# Altium project Golden_Nonce_Rev01.PrjPCB (part 2 of 6)

## Sheet GS_02_Core.SchDoc: Title
size A2; Date: Date; CompanyName: Integrated Micro-Electronics Bulgaria; Organization: Design & Development Department; Address1: Drawing Type; Address2: Address 1; Address3: Address 2; Address4: Address 3; DocumentNumber: 730xxx; Revision: 01; SheetNumber: 1; SheetTotal: 1; PageSetup: Record=PageOptions|CenterHorizontal=True|CenterVertical=True|PrintScale=0.70|XCorrection=1.00|YCorrection=1.00|PrintKind=2|BorderSize=5000000|LeftOffset=0|BottomOffset=0|Orientation=2|PaperLength=1000|PaperWidth=1000|Scale=100|PaperSource=7|PrintQuality=-4|MediaType=1|DitherType=10|PaperKind=A4|PrintScaleMode=1; SheetSize: A3; Time: Time; ModifiedDate: Mod. Date
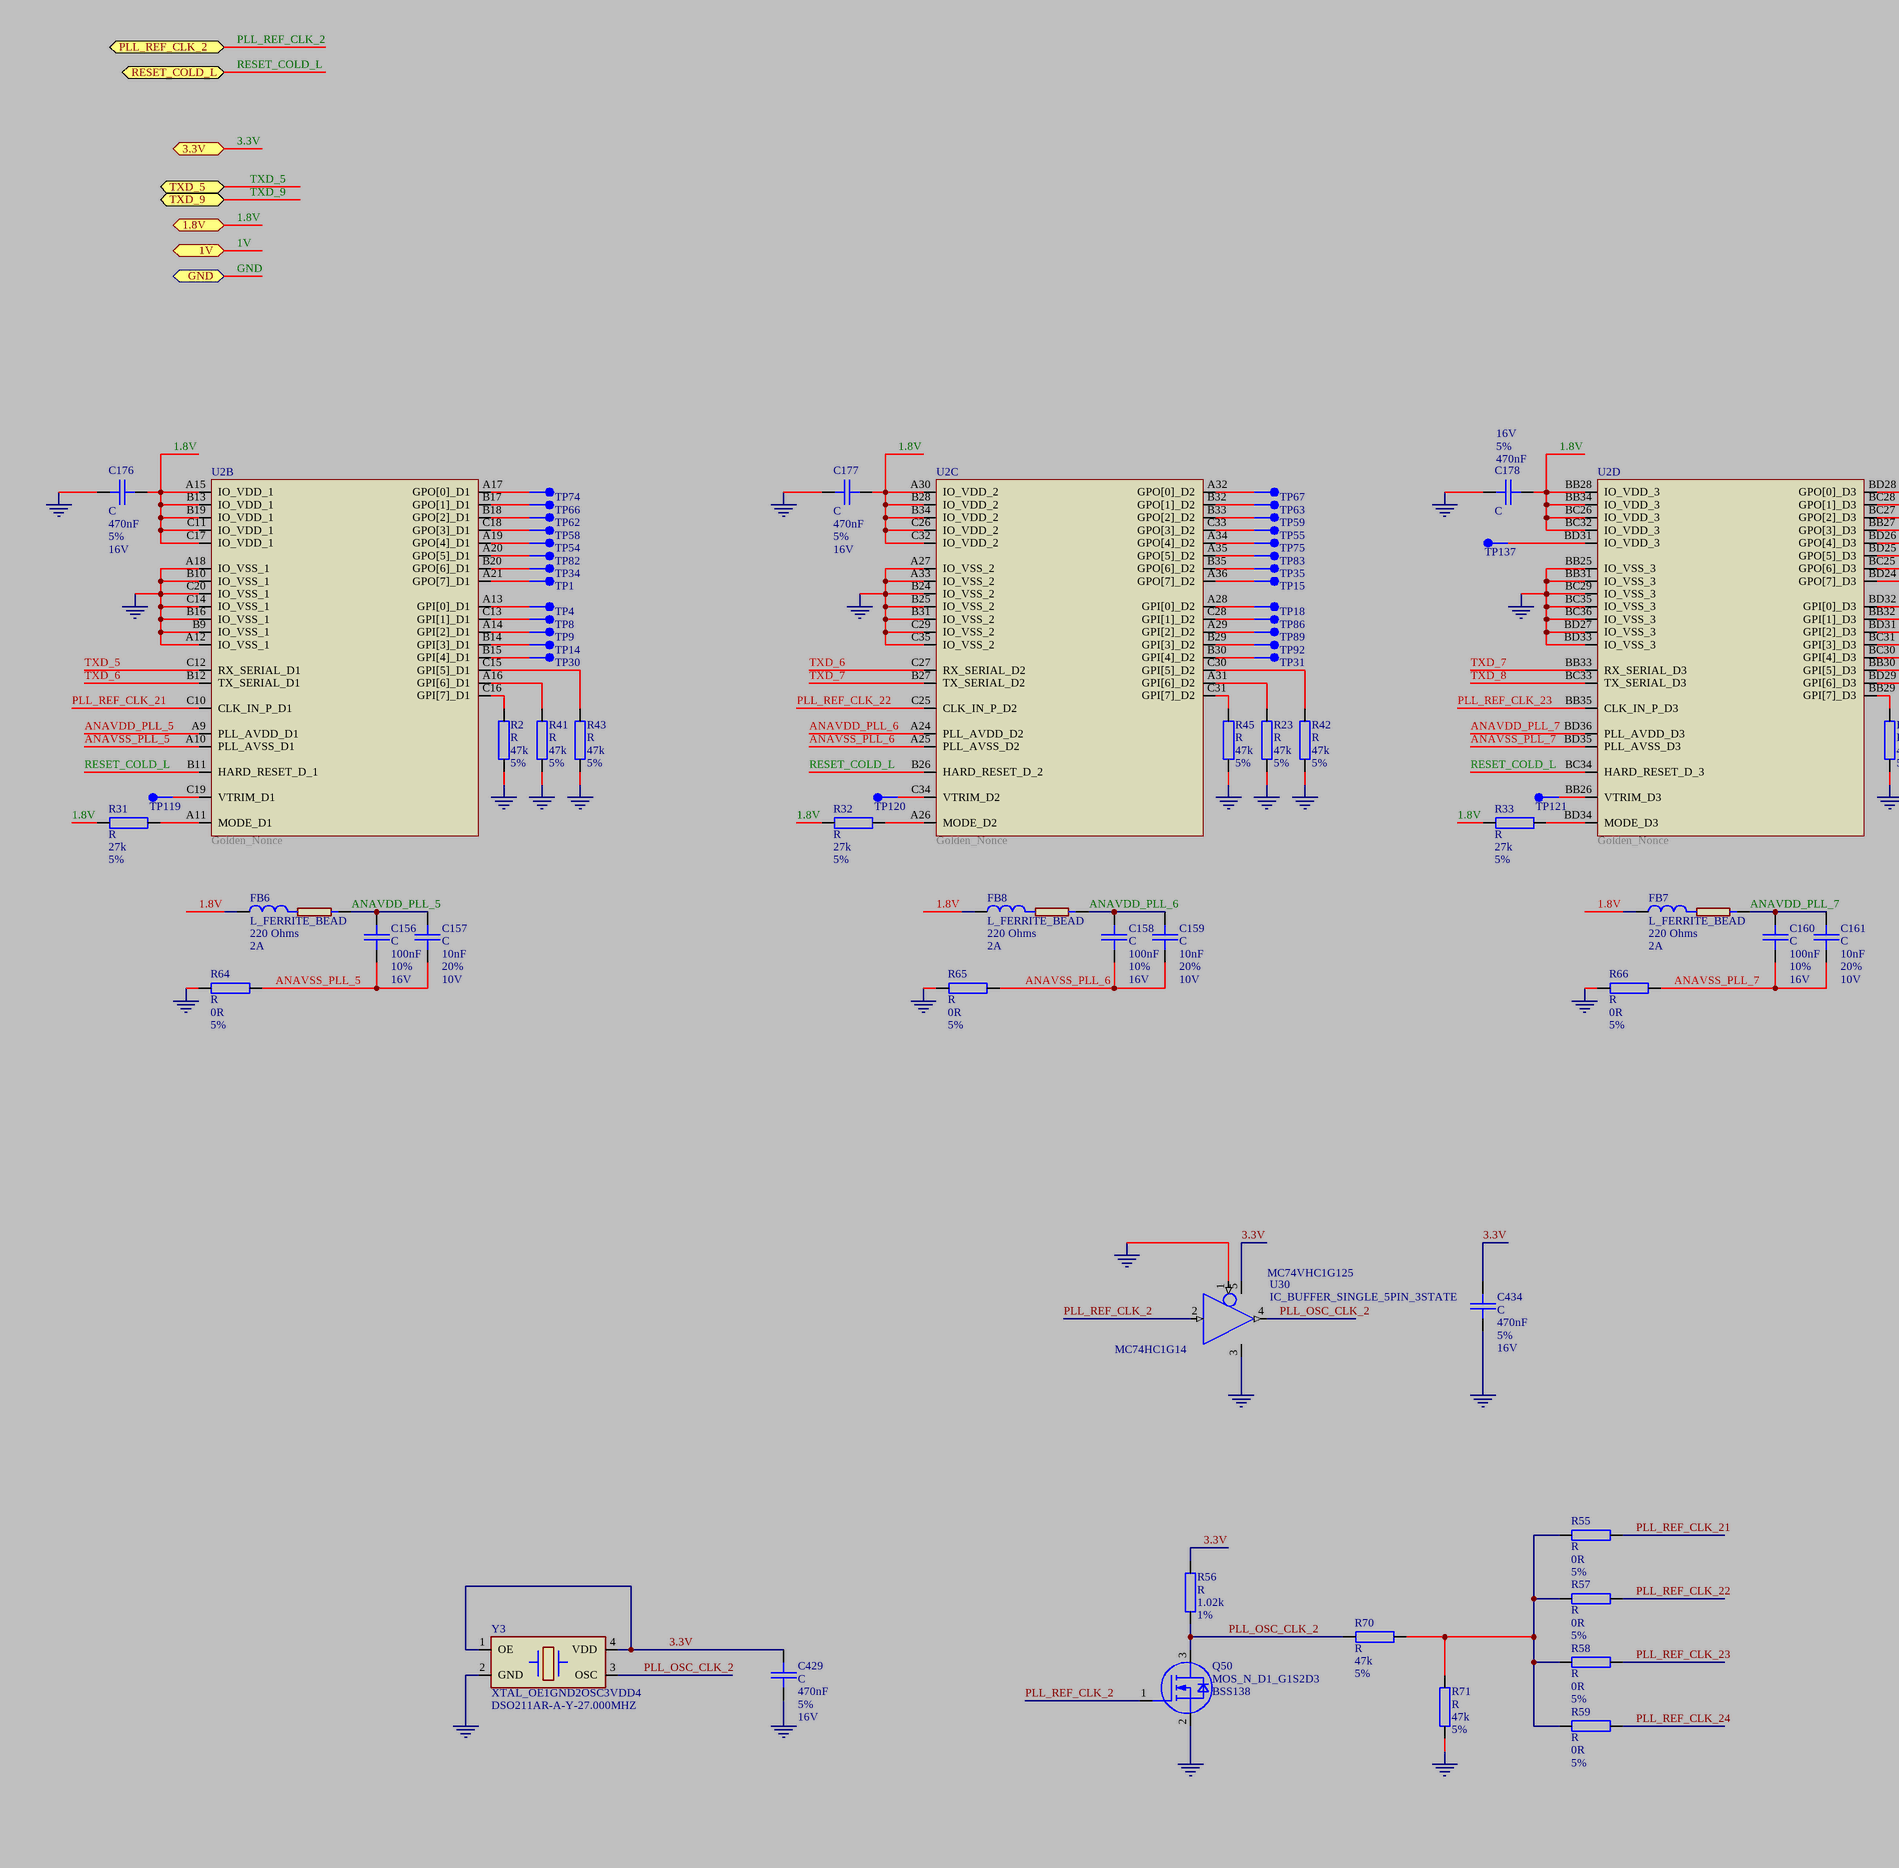
[diagram p3: GS_02_Core.SchDoc, left]
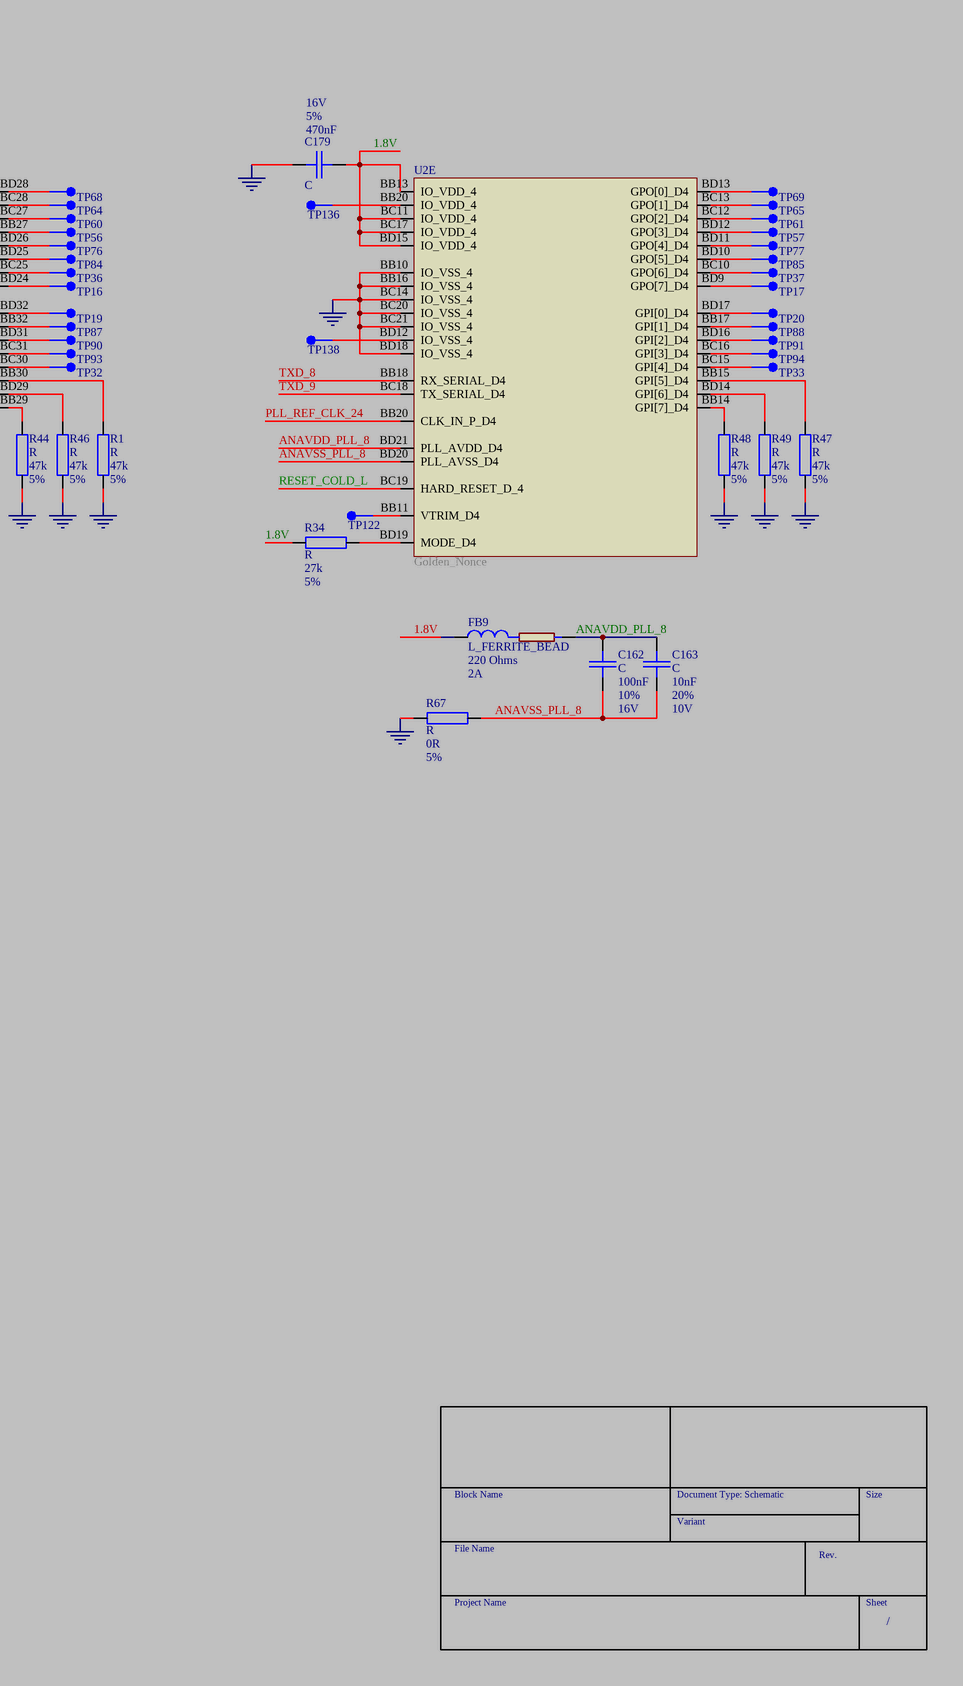
[diagram p4: GS_02_Core.SchDoc, right]

### Parts
C156  C  DB_VALUE: 100nF  DB_TOLERANCE: 10%  DB_VOLTAGE: 16V  [SMD_0603_CAPC1608X95N]
C157  C  DB_VALUE: 10nF  DB_TOLERANCE: 20%  DB_VOLTAGE: 10V  [SMD_0603_CAPC1608X95N]
C158  C  DB_VALUE: 100nF  DB_TOLERANCE: 10%  DB_VOLTAGE: 16V  [SMD_0603_CAPC1608X95N]
C159  C  DB_VALUE: 10nF  DB_TOLERANCE: 20%  DB_VOLTAGE: 10V  [SMD_0603_CAPC1608X95N]
C160  C  DB_VALUE: 100nF  DB_TOLERANCE: 10%  DB_VOLTAGE: 16V  [SMD_0603_CAPC1608X95N]
C161  C  DB_VALUE: 10nF  DB_TOLERANCE: 20%  DB_VOLTAGE: 10V  [SMD_0603_CAPC1608X95N]
C162  C  DB_VALUE: 100nF  DB_TOLERANCE: 10%  DB_VOLTAGE: 16V  [SMD_0603_CAPC1608X95N]
C163  C  DB_VALUE: 10nF  DB_TOLERANCE: 20%  DB_VOLTAGE: 10V  [SMD_0603_CAPC1608X95N]
C176  C  DB_VALUE: 470nF  DB_TOLERANCE: 5%  DB_VOLTAGE: 16V  [SMD_0603_CAPC1608X95N]
C177  C  DB_VALUE: 470nF  DB_TOLERANCE: 5%  DB_VOLTAGE: 16V  [SMD_0603_CAPC1608X95N]
C178  C  DB_VALUE: 470nF  DB_TOLERANCE: 5%  DB_VOLTAGE: 16V  [SMD_0603_CAPC1608X95N]
C179  C  DB_VALUE: 470nF  DB_TOLERANCE: 5%  DB_VOLTAGE: 16V  [SMD_0603_CAPC1608X95N]
C429  C  DB_VALUE: 470nF  DB_TOLERANCE: 5%  DB_VOLTAGE: 16V  [SMD_0603_CAPC1608X95N]
C434  C  DB_VALUE: 470nF  DB_TOLERANCE: 5%  DB_VOLTAGE: 16V  [SMD_0603_CAPC1608X95N]
FB6  L_FERRITE_BEAD  DB_VALUE: 220 Ohms  DB_CURRENT: 2A  [SMD_0805_INDC2012X105N]
FB7  L_FERRITE_BEAD  DB_VALUE: 220 Ohms  DB_CURRENT: 2A  [SMD_0805_INDC2012X105N]
FB8  L_FERRITE_BEAD  DB_VALUE: 220 Ohms  DB_CURRENT: 2A  [SMD_0805_INDC2012X105N]
FB9  L_FERRITE_BEAD  DB_VALUE: 220 Ohms  DB_CURRENT: 2A  [SMD_0805_INDC2012X105N]
Q50  MOS_N_D1_G1S2D3  DB_VALUE: BSS138  [SMD_SOT23_SOT95P240X112-3N]
R1  R  DB_VALUE: 47k  DB_TOLERANCE: 5%  [SMD_0603_RESC1608X55N]
R2  R  DB_VALUE: 47k  DB_TOLERANCE: 5%  [SMD_0603_RESC1608X55N]
R23  R  DB_VALUE: 47k  DB_TOLERANCE: 5%  [SMD_0603_RESC1608X55N]
R31  R  DB_VALUE: 27k  DB_TOLERANCE: 5%  [SMD_0603_RESC1608X55N]
R32  R  DB_VALUE: 27k  DB_TOLERANCE: 5%  [SMD_0603_RESC1608X55N]
R33  R  DB_VALUE: 27k  DB_TOLERANCE: 5%  [SMD_0603_RESC1608X55N]
R34  R  DB_VALUE: 27k  DB_TOLERANCE: 5%  [SMD_0603_RESC1608X55N]
R41  R  DB_VALUE: 47k  DB_TOLERANCE: 5%  [SMD_0603_RESC1608X55N]
R42  R  DB_VALUE: 47k  DB_TOLERANCE: 5%  [SMD_0603_RESC1608X55N]
R43  R  DB_VALUE: 47k  DB_TOLERANCE: 5%  [SMD_0603_RESC1608X55N]
R44  R  DB_VALUE: 47k  DB_TOLERANCE: 5%  [SMD_0603_RESC1608X55N]
R45  R  DB_VALUE: 47k  DB_TOLERANCE: 5%  [SMD_0603_RESC1608X55N]
R46  R  DB_VALUE: 47k  DB_TOLERANCE: 5%  [SMD_0603_RESC1608X55N]
R47  R  DB_VALUE: 47k  DB_TOLERANCE: 5%  [SMD_0603_RESC1608X55N]
R48  R  DB_VALUE: 47k  DB_TOLERANCE: 5%  [SMD_0603_RESC1608X55N]
R49  R  DB_VALUE: 47k  DB_TOLERANCE: 5%  [SMD_0603_RESC1608X55N]
R55  R  DB_VALUE: 0R  DB_TOLERANCE: 5%  [SMD_0603_RESC1608X55N]
R56  R  DB_VALUE: 1.02k  DB_TOLERANCE: 1%  [SMD_0603_RESC1608X55N]
R57  R  DB_VALUE: 0R  DB_TOLERANCE: 5%  [SMD_0603_RESC1608X55N]
R58  R  DB_VALUE: 0R  DB_TOLERANCE: 5%  [SMD_0603_RESC1608X55N]
R59  R  DB_VALUE: 0R  DB_TOLERANCE: 5%  [SMD_0603_RESC1608X55N]
R64  R  DB_VALUE: 0R  DB_TOLERANCE: 5%  [SMD_0402_RESC1005X37N]
R65  R  DB_VALUE: 0R  DB_TOLERANCE: 5%  [SMD_0402_RESC1005X37N]
R66  R  DB_VALUE: 0R  DB_TOLERANCE: 5%  [SMD_0402_RESC1005X37N]
R67  R  DB_VALUE: 0R  DB_TOLERANCE: 5%  [SMD_0402_RESC1005X37N]
R70  R  DB_VALUE: 47k  DB_TOLERANCE: 5%  [SMD_0603_RESC1608X55N]
R71  R  DB_VALUE: 47k  DB_TOLERANCE: 5%  [SMD_0603_RESC1608X55N]
TP1  TEST_POINT_1  [SMD_TP_100-254]  (value not drawn)
TP4  TEST_POINT_1  [SMD_TP_100-254]  (value not drawn)
TP8  TEST_POINT_1  [SMD_TP_100-254]  (value not drawn)
TP9  TEST_POINT_1  [SMD_TP_100-254]  (value not drawn)
TP14  TEST_POINT_1  [SMD_TP_100-254]  (value not drawn)
TP15  TEST_POINT_1  [SMD_TP_100-254]  (value not drawn)
TP16  TEST_POINT_1  [SMD_TP_100-254]  (value not drawn)
TP17  TEST_POINT_1  [SMD_TP_100-254]  (value not drawn)
TP18  TEST_POINT_1  [SMD_TP_100-254]  (value not drawn)
TP19  TEST_POINT_1  [SMD_TP_100-254]  (value not drawn)
TP20  TEST_POINT_1  [SMD_TP_100-254]  (value not drawn)
TP30  TEST_POINT_1  [SMD_TP_100-254]  (value not drawn)
TP31  TEST_POINT_1  [SMD_TP_100-254]  (value not drawn)
TP32  TEST_POINT_1  [SMD_TP_100-254]  (value not drawn)
TP33  TEST_POINT_1  [SMD_TP_100-254]  (value not drawn)
TP34  TEST_POINT_1  [SMD_TP_100-254]  (value not drawn)
TP35  TEST_POINT_1  [SMD_TP_100-254]  (value not drawn)
TP36  TEST_POINT_1  [SMD_TP_100-254]  (value not drawn)
TP37  TEST_POINT_1  [SMD_TP_100-254]  (value not drawn)
TP54  TEST_POINT_1  [SMD_TP_100-254]  (value not drawn)
TP55  TEST_POINT_1  [SMD_TP_100-254]  (value not drawn)
TP56  TEST_POINT_1  [SMD_TP_100-254]  (value not drawn)
TP57  TEST_POINT_1  [SMD_TP_100-254]  (value not drawn)
TP58  TEST_POINT_1  [SMD_TP_100-254]  (value not drawn)
TP59  TEST_POINT_1  [SMD_TP_100-254]  (value not drawn)
TP60  TEST_POINT_1  [SMD_TP_100-254]  (value not drawn)
TP61  TEST_POINT_1  [SMD_TP_100-254]  (value not drawn)
TP62  TEST_POINT_1  [SMD_TP_100-254]  (value not drawn)
TP63  TEST_POINT_1  [SMD_TP_100-254]  (value not drawn)
TP64  TEST_POINT_1  [SMD_TP_100-254]  (value not drawn)
TP65  TEST_POINT_1  [SMD_TP_100-254]  (value not drawn)
TP66  TEST_POINT_1  [SMD_TP_100-254]  (value not drawn)
TP67  TEST_POINT_1  [SMD_TP_100-254]  (value not drawn)
TP68  TEST_POINT_1  [SMD_TP_100-254]  (value not drawn)
TP69  TEST_POINT_1  [SMD_TP_100-254]  (value not drawn)
TP74  TEST_POINT_1  [SMD_TP_100-254]  (value not drawn)
TP75  TEST_POINT_1  [SMD_TP_100-254]  (value not drawn)
TP76  TEST_POINT_1  [SMD_TP_100-254]  (value not drawn)
TP77  TEST_POINT_1  [SMD_TP_100-254]  (value not drawn)
TP82  TEST_POINT_1  [SMD_TP_100-254]  (value not drawn)
TP83  TEST_POINT_1  [SMD_TP_100-254]  (value not drawn)
TP84  TEST_POINT_1  [SMD_TP_100-254]  (value not drawn)
TP85  TEST_POINT_1  [SMD_TP_100-254]  (value not drawn)
TP86  TEST_POINT_1  [SMD_TP_100-254]  (value not drawn)
TP87  TEST_POINT_1  [SMD_TP_100-254]  (value not drawn)
TP88  TEST_POINT_1  [SMD_TP_100-254]  (value not drawn)
TP89  TEST_POINT_1  [SMD_TP_100-254]  (value not drawn)
TP90  TEST_POINT_1  [SMD_TP_100-254]  (value not drawn)
TP91  TEST_POINT_1  [SMD_TP_100-254]  (value not drawn)
TP92  TEST_POINT_1  [SMD_TP_100-254]  (value not drawn)
TP93  TEST_POINT_1  [SMD_TP_100-254]  (value not drawn)
TP94  TEST_POINT_1  [SMD_TP_100-254]  (value not drawn)
TP119  TEST_POINT_1  [SMD_TP_100-254]  (value not drawn)
TP120  TEST_POINT_1  [SMD_TP_100-254]  (value not drawn)
TP121  TEST_POINT_1  [SMD_TP_100-254]  (value not drawn)
TP122  TEST_POINT_1  [SMD_TP_100-254]  (value not drawn)
TP136  TEST_POINT_1  [SMD_TP_100-254]  (value not drawn)
TP137  TEST_POINT_1  [SMD_TP_100-254]  (value not drawn)
TP138  TEST_POINT_1  [SMD_TP_100-254]  (value not drawn)
U2  Golden_Nonce  (parts B,C,D,E of 5)
U30  IC_BUFFER_SINGLE_5PIN_3STATE  DB_VALUE: MC74VHC1G125  [SMD_SOT95P280X110-5N]
Y3  XTAL_OE1GND2OSC3VDD4  DB_VALUE: DSO211AR-A-Y-27.000MHZ  [SMD_OSCCC500X700X100-4N]

### Ports
1.8V, 1V, 3.3V, GND, PLL_REF_CLK_2, RESET_COLD_L, TXD_5, TXD_9

### Nets
GND: C176.1 C177.1 C178.1 C179.1 C429.1 C434.1 Q50.2(S) R1.2 R2.2 R23.2 R41.2 R42.2 R43.2 R44.2 R45.2 R46.2 R47.2 R48.2 R49.2 R64.1 R65.1 R66.1 R67.1 R71.2 U2.A12(IO_VSS_1) U2.A18(IO_VSS_1) U2.A27(IO_VSS_2) U2.A33(IO_VSS_2) U2.B9(IO_VSS_1) U2.B10(IO_VSS_1) U2.B16(IO_VSS_1) U2.B24(IO_VSS_2) U2.B25(IO_VSS_2) U2.B31(IO_VSS_2) U2.BB10(IO_VSS_4) U2.BB16(IO_VSS_4) U2.BB25(IO_VSS_3) U2.BB31(IO_VSS_3) U2.BC14(IO_VSS_4) U2.BC20(IO_VSS_4) U2.BC21(IO_VSS_4) U2.BC29(IO_VSS_3) U2.BC35(IO_VSS_3) U2.BC36(IO_VSS_3) U2.BD18(IO_VSS_4) U2.BD27(IO_VSS_3) U2.BD33(IO_VSS_3) U2.C14(IO_VSS_1) U2.C20(IO_VSS_1) U2.C29(IO_VSS_2) U2.C35(IO_VSS_2) U30.1(~{OE}) U30.3(GND) Y3.2(GND) ; port GND
1.8V: C176.2 C177.2 C178.2 C179.2 FB6.1 FB7.1 FB8.1 FB9.1 R31.1 R32.1 R33.1 R34.1 U2.A15(IO_VDD_1) U2.A30(IO_VDD_2) U2.B13(IO_VDD_1) U2.B19(IO_VDD_1) U2.B28(IO_VDD_2) U2.B34(IO_VDD_2) U2.BB13(IO_VDD_4) U2.BB28(IO_VDD_3) U2.BB34(IO_VDD_3) U2.BC11(IO_VDD_4) U2.BC17(IO_VDD_4) U2.BC26(IO_VDD_3) U2.BC32(IO_VDD_3) U2.BD15(IO_VDD_4) U2.C11(IO_VDD_1) U2.C17(IO_VDD_1) U2.C26(IO_VDD_2) U2.C32(IO_VDD_2) ; port 1.8V
3.3V: C429.2 C434.2 R56.1 U30.5(VCC) Y3.1(OE) Y3.4(VDD) ; port 3.3V
ANAVDD_PLL_5: C156.1 C157.1 FB6.2 U2.A9(PLL_AVDD_D1)
ANAVDD_PLL_6: C158.1 C159.1 FB8.2 U2.A24(PLL_AVDD_D2)
ANAVDD_PLL_7: C160.1 C161.1 FB7.2 U2.BD36(PLL_AVDD_D3)
ANAVDD_PLL_8: C162.1 C163.1 FB9.2 U2.BD21(PLL_AVDD_D4)
ANAVSS_PLL_5: C156.2 C157.2 R64.2 U2.A10(PLL_AVSS_D1)
ANAVSS_PLL_6: C158.2 C159.2 R65.2 U2.A25(PLL_AVSS_D2)
ANAVSS_PLL_7: C160.2 C161.2 R66.2 U2.BD35(PLL_AVSS_D3)
ANAVSS_PLL_8: C162.2 C163.2 R67.2 U2.BD20(PLL_AVSS_D4)
PLL_OSC_CLK_2: Q50.3(D) R56.2 R70.1 U30.4(OUTY) Y3.3(OSC)
PLL_REF_CLK_2: Q50.1(G) U30.2(INA) ; port PLL_REF_CLK_2
PLL_REF_CLK_21: R55.2 U2.C10(CLK_IN_P_D1)
PLL_REF_CLK_22: R57.2 U2.C25(CLK_IN_P_D2)
PLL_REF_CLK_23: R58.2 U2.BB35(CLK_IN_P_D3)
PLL_REF_CLK_24: R59.2 U2.BB20(CLK_IN_P_D4)
RESET_COLD_L: U2.B11(HARD_RESET_D_1) U2.B26(HARD_RESET_D_2) U2.BC19(HARD_RESET_D_4) U2.BC34(HARD_RESET_D_3) ; port RESET_COLD_L
TXD_5: U2.C12(RX_SERIAL_D1) ; port TXD_5
TXD_6: U2.B12(TX_SERIAL_D1) U2.C27(RX_SERIAL_D2)
TXD_7: U2.B27(TX_SERIAL_D2) U2.BB33(RX_SERIAL_D3)
TXD_8: U2.BB18(RX_SERIAL_D4) U2.BC33(TX_SERIAL_D3)
TXD_9: U2.BC18(TX_SERIAL_D4) ; port TXD_9
NetR1_1: R1.1 U2.BB30(GPI[5]_D3)
NetR2_1: R2.1 U2.C16(GPI[7]_D1)
NetR23_1: R23.1 U2.A31(GPI[6]_D2)
NetR31_2: R31.2 U2.A11(MODE_D1)
NetR32_2: R32.2 U2.A26(MODE_D2)
NetR33_2: R33.2 U2.BD34(MODE_D3)
NetR34_2: R34.2 U2.BD19(MODE_D4)
NetR41_1: R41.1 U2.A16(GPI[6]_D1)
NetR42_1: R42.1 U2.C30(GPI[5]_D2)
NetR43_1: R43.1 U2.C15(GPI[5]_D1)
NetR44_1: R44.1 U2.BB29(GPI[7]_D3)
NetR45_1: R45.1 U2.C31(GPI[7]_D2)
NetR46_1: R46.1 U2.BD29(GPI[6]_D3)
NetR47_1: R47.1 U2.BB15(GPI[5]_D4)
NetR48_1: R48.1 U2.BB14(GPI[7]_D4)
NetR49_1: R49.1 U2.BD14(GPI[6]_D4)
NetR55_1: R55.1 R57.1 R58.1 R59.1 R70.2 R71.1
NetTP1_1: TP1.1 U2.A21(GPO[7]_D1)
NetTP4_1: TP4.1 U2.A13(GPI[0]_D1)
NetTP8_1: TP8.1 U2.C13(GPI[1]_D1)
NetTP9_1: TP9.1 U2.A14(GPI[2]_D1)
NetTP14_1: TP14.1 U2.B14(GPI[3]_D1)
NetTP15_1: TP15.1 U2.A36(GPO[7]_D2)
NetTP16_1: TP16.1 U2.BD24(GPO[7]_D3)
NetTP17_1: TP17.1 U2.BD9(GPO[7]_D4)
NetTP18_1: TP18.1 U2.A28(GPI[0]_D2)
NetTP19_1: TP19.1 U2.BD32(GPI[0]_D3)
NetTP20_1: TP20.1 U2.BD17(GPI[0]_D4)
NetTP30_1: TP30.1 U2.B15(GPI[4]_D1)
NetTP31_1: TP31.1 U2.B30(GPI[4]_D2)
NetTP32_1: TP32.1 U2.BC30(GPI[4]_D3)
NetTP33_1: TP33.1 U2.BC15(GPI[4]_D4)
NetTP34_1: TP34.1 U2.B20(GPO[6]_D1)
NetTP35_1: TP35.1 U2.B35(GPO[6]_D2)
NetTP36_1: TP36.1 U2.BC25(GPO[6]_D3)
NetTP37_1: TP37.1 U2.BC10(GPO[6]_D4)
NetTP54_1: TP54.1 U2.A19(GPO[4]_D1)
NetTP55_1: TP55.1 U2.C33(GPO[3]_D2)
NetTP56_1: TP56.1 U2.BB27(GPO[3]_D3)
NetTP57_1: TP57.1 U2.BD12(GPO[3]_D4)
NetTP58_1: TP58.1 U2.C18(GPO[3]_D1)
NetTP59_1: TP59.1 U2.B33(GPO[2]_D2)
NetTP60_1: TP60.1 U2.BC27(GPO[2]_D3)
NetTP61_1: TP61.1 U2.BC12(GPO[2]_D4)
NetTP62_1: TP62.1 U2.B18(GPO[2]_D1)
NetTP63_1: TP63.1 U2.B32(GPO[1]_D2)
NetTP64_1: TP64.1 U2.BC28(GPO[1]_D3)
NetTP65_1: TP65.1 U2.BC13(GPO[1]_D4)
NetTP66_1: TP66.1 U2.B17(GPO[1]_D1)
NetTP67_1: TP67.1 U2.A32(GPO[0]_D2)
NetTP68_1: TP68.1 U2.BD28(GPO[0]_D3)
NetTP69_1: TP69.1 U2.BD13(GPO[0]_D4)
NetTP74_1: TP74.1 U2.A17(GPO[0]_D1)
NetTP75_1: TP75.1 U2.A34(GPO[4]_D2)
NetTP76_1: TP76.1 U2.BD26(GPO[4]_D3)
NetTP77_1: TP77.1 U2.BD11(GPO[4]_D4)
NetTP82_1: TP82.1 U2.A20(GPO[5]_D1)
NetTP83_1: TP83.1 U2.A35(GPO[5]_D2)
NetTP84_1: TP84.1 U2.BD25(GPO[5]_D3)
NetTP85_1: TP85.1 U2.BD10(GPO[5]_D4)
NetTP86_1: TP86.1 U2.C28(GPI[1]_D2)
NetTP87_1: TP87.1 U2.BB32(GPI[1]_D3)
NetTP88_1: TP88.1 U2.BB17(GPI[1]_D4)
NetTP89_1: TP89.1 U2.A29(GPI[2]_D2)
NetTP90_1: TP90.1 U2.BD31(GPI[2]_D3)
NetTP91_1: TP91.1 U2.BD16(GPI[2]_D4)
NetTP92_1: TP92.1 U2.B29(GPI[3]_D2)
NetTP93_1: TP93.1 U2.BC31(GPI[3]_D3)
NetTP94_1: TP94.1 U2.BC16(GPI[3]_D4)
NetTP119_1: TP119.1 U2.C19(VTRIM_D1)
NetTP120_1: TP120.1 U2.C34(VTRIM_D2)
NetTP121_1: TP121.1 U2.BB26(VTRIM_D3)
NetTP122_1: TP122.1 U2.BB11(VTRIM_D4)
NetTP136_1: TP136.1 U2.BB20(IO_VDD_4)
NetTP137_1: TP137.1 U2.BD31(IO_VDD_3)
NetTP138_1: TP138.1 U2.BD12(IO_VSS_4)

### Notes on the sheet
- (near U30) MC74HC1G14
- Block Name
- Document Type: Schematic
- Size
- File Name
- Variant
- Rev.
- Project Name
- Sheet
- /

### Library data of the parts
C156 C158 C160 C162 = CAP000047357: DB_MANUFACTURER_PART: YAGEO      223878615649; DB_PART_TYPE: Ceramic_SMD\Standard_X7R; NOTE: <NOTE>; DB_APPROVED_BY: VSN; DB_DESCRIPTION: C X7R 100nF 10% 16V 0603; DB_PACKAGE: 0603; DB_STATUS: NEW; DB_T_RANGE: -55 to 125; DB_PART_NUMBER: CAP000047357; DB_APPROVED_ON: 16.05.2014 14:44:10; DB_DATASHEET: http://john.epiqdesign.com/projects/CIS_Datasheets/22_X7R_YAGEO_capacitor_series_9.pdf?rev=1422&sc=0; DB_PCB_DEVICE: SMD_0603_CAPC1608X95N
C157 C159 C161 C163 = CAP000038821: DB_MANUFACTURER_PART: KEMET    C0603C103M8GAC; DB_PART_TYPE: Ceramic_SMD\Standard_C0G; NOTE: <NOTE>; DB_DESCRIPTION: C C0G 10nF 20% 10V 0603; DB_PACKAGE: 0603; DB_STATUS: NEW; DB_T_RANGE: -55 to 125; DB_PART_NUMBER: CAP000038821; DB_APPROVED_ON: 09.10.2010; DB_DATASHEET: http://john.epiqdesign.com/projects/CIS_Datasheets/F3102_CE_Kemet.pdf?rev=92&sc=0; DB_PCB_DEVICE: SMD_0603_CAPC1608X95N
C176-C179 C429 C434 = CAP000028169: DB_PART_TYPE: Ceramic_SMD\Standard_X7R; DB_MANUFACTURER_PART: KEMET    C0603C474J4RAC; NOTE: <NOTE>; DB_T_RANGE: -55 to 125; DB_PACKAGE: 0603; DB_DESCRIPTION: C X7R 470nF 5% 16V 0603; DB_STATUS: NEW; DB_PART_NUMBER: CAP000028169; DB_PCB_DEVICE: SMD_0603_CAPC1608X95N; DB_APPROVED_ON: 09.10.2010; DB_DATASHEET: http://john.epiqdesign.com/projects/CIS_Datasheets/F3102_CE_Kemet.pdf?rev=92&sc=0
FB6-FB9 = IND000000029: DB_PART_TYPE: Inductor; DB_MANUFACTURER_PART: MURATA       BLM21PG221SN1D; NOTE: <NOTE>; DB_TOLERANCE: 25%; DB_T_RANGE: -55 to 125; DB_PACKAGE: 0805; DB_DESCRIPTION: INDUC 220 Ohms 25% 0805; DB_APPROVED_BY: VSN; DB_STATUS: NEW; DB_PART_NUMBER: IND000000029; DB_PCB_DEVICE: SMD_0805_INDC2012X105N; DB_APPROVED_ON: 30.06.2011 07:59:29; DB_DATASHEET: http://john.epiqdesign.com/projects/CIS_Datasheets/BLM21P_MURATA.pdf?rev=325&sc=0
Q50 = TRA000001460: DB_PART_TYPE: MOSFET\N_Channel; DB_MANUFACTURER_PART: FAIRCHILD        BSS138LT1G; NOTE: <NOTE>; DB_T_RANGE: -55 to 150; DB_VOLTAGE: 50V; DB_CURRENT: 0.22A; DB_PACKAGE: SOT-23-3; DB_DESCRIPTION: TRANS BSS138 SOT-23-3; DB_APPROVED_BY: VSN; DB_STATUS: NEW; DB_PART_NUMBER: TRA000001460; DB_PCB_DEVICE: SMD_SOT23_SOT95P240X112-3N; DB_APPROVED_ON: 14.01.2011 10:29:14; DB_DATASHEET: http://john.epiqdesign.com/projects/CIS_Datasheets/BSS138LT1-D_Fairchild.pdf?rev=55&sc=0
R1 R2 R23 R41-R49 R70 R71 = RES000006462: DB_PART_TYPE: SMD; DB_MANUFACTURER_PART: YAGEO    RC0603JR-0747K; NOTE: <NOTE>; DB_T_RANGE: -55 to 155; DB_POWER: 1/10W; DB_PACKAGE: 0603; DB_DESCRIPTION: R SMD 47K 5% 1/10W 0603; DB_PRICE: 0.000364; DB_MOQ: 5000; DB_STATUS: NEW; R_BDS: R; DB_PART_NUMBER: RES000006462; DB_PCB_DEVICE: SMD_0603_RESC1608X55N; DB_PRICE_DATE: 2010-12-23; DB_APPROVED_ON: 09.10.2010; DB_DATASHEET: http://john.epiqdesign.com/projects/CIS_Datasheets/PYu-RC0603_51_RoHS_L_4_YAGEO.pdf?rev=138&sc=0
R31-R34 = RES000006456: DB_PART_TYPE: SMD; DB_MANUFACTURER_PART: YAGEO    RC0603JR-0727K; NOTE: <NOTE>; DB_T_RANGE: -55 to 155; DB_POWER: 1/10W; DB_PACKAGE: 0603; DB_DESCRIPTION: R SMD 27K 5% 1/10W 0603; DB_PRICE: 0.000364; DB_MOQ: 5000; DB_STATUS: NEW; R_BDS: R; DB_PART_NUMBER: RES000006456; DB_PCB_DEVICE: SMD_0603_RESC1608X55N; DB_PRICE_DATE: 2010-12-23; DB_APPROVED_ON: 09.10.2010; DB_DATASHEET: http://john.epiqdesign.com/projects/CIS_Datasheets/PYu-RC0603_51_RoHS_L_4_YAGEO.pdf?rev=138&sc=0
R55 R57-R59 = RES000006349: DB_PART_TYPE: SMD; DB_MANUFACTURER_PART: YAGEO    RC0603JR-070R; NOTE: <NOTE>; DB_T_RANGE: -55 to 155; DB_POWER: 1/10W; DB_PACKAGE: 0603; DB_DESCRIPTION: R SMD 0R 5% 1/10W 0603; DB_PRICE: 0.000364; DB_MOQ: 5000; DB_STATUS: NEW; R_BDS: R; DB_PART_NUMBER: RES000006349; DB_PCB_DEVICE: SMD_0603_RESC1608X55N; DB_PRICE_DATE: 2010-12-23; DB_APPROVED_ON: 09.10.2010; DB_DATASHEET: http://john.epiqdesign.com/projects/CIS_Datasheets/PYu-RC0603_51_RoHS_L_4_YAGEO.pdf?rev=138&sc=0
R56 = RES000001446: DB_PART_TYPE: SMD; DB_MANUFACTURER_PART: YAGEO    RC0603FR-071K02; NOTE: <NOTE>; DB_T_RANGE: -55 to 155; DB_POWER: 1/10W; DB_PACKAGE: 0603; DB_DESCRIPTION: R SMD 1K02 1% 1/10W 0603; DB_PRICE: 0.00063; DB_MOQ: 5000; DB_STATUS: NEW; R_BDS: R; DB_PART_NUMBER: RES000001446; DB_PCB_DEVICE: SMD_0603_RESC1608X55N; DB_PRICE_DATE: 2010-12-23; DB_APPROVED_ON: 09.10.2010; DB_DATASHEET: http://john.epiqdesign.com/projects/CIS_Datasheets/PYu-RC0603_51_RoHS_L_4_YAGEO.pdf?rev=138&sc=0
R64-R67 = RES000006002: DB_PART_TYPE: SMD; DB_MANUFACTURER_PART: YAGEO    RC0402JR-070R; NOTE: <NOTE>; DB_T_RANGE: -55 to 155; DB_POWER: 1/16W; DB_PACKAGE: 0402; DB_DESCRIPTION: R SMD 0R 5% 1/16W 0402; DB_PRICE: 0.00066; DB_MOQ: 10000; DB_STATUS: NEW; R_BDS: R; DB_PART_NUMBER: RES000006002; DB_PCB_DEVICE: SMD_0402_RESC1005X37N; DB_PRICE_DATE: 2010-12-23; DB_APPROVED_ON: 09.10.2010; DB_DATASHEET: http://john.epiqdesign.com/projects/CIS_Datasheets/PYu-RC0402_51_RoHS_L_6_YAGEO.pdf?rev=138&sc=0
TP1 TP4 TP8 TP9 TP14-TP20 TP30-TP37 TP54-TP69 TP74-TP77 TP82-TP94 TP119-TP122 TP136-TP138 = TPO000000001: DB_PART_TYPE: Test Point; DB_VALUE: 100_254; DB_DESCRIPTION: Test Point 100_254; DB_STATUS: NEW; DB_PART_NUMBER: TPO000000001; DB_DIAMETER: 100_254; DB_PCB_DEVICE: SMD_TP_100-254; DB_APPROVED_ON: 10.09.2010
U30 = DIG000000005: DB_PART_TYPE: Buffer; DB_MANUFACTURER_PART: ON Semiconductor       M74VHC1G125DTT1G; NOTE: <NOTE>; DB_T_RANGE: -55 to 125; DB_PACKAGE: SOT23-5; DB_DESCRIPTION: IC MC74VHC1G125 SOT23-5; DB_APPROVED_BY: VSN; DB_STATUS: NEW; DB_PART_NUMBER: DIG000000005; DB_PCB_DEVICE: SMD_SOT95P280X110-5N; DB_APPROVED_ON: 13.10.2011 11:24:30; DB_DATASHEET: http://john.epiqdesign.com/projects/CIS_Datasheets/MC74VHC1G125-DNoninverting_3-State_Buffer_ON_Semi.pdf?rev=477&sc=0
Y3 = OSC000000015: DB_PART_TYPE: Oscillator; DB_MANUFACTURER_PART: KDS DAISHINKU      DSO211AR-A-Y-27.000MHZ; NOTE: <NOTE>; DB_ACCURACY: 100ppm; DB_T_RANGE: -40 to 125; DB_VOLTAGE: 3.3V; DB_FREQUENCY: 27MHz; DB_PACKAGE: SMT; DB_DESCRIPTION: IC DSO211AR 27MHZ; DB_PCB_DEVICE: SMD_OSCCC160X200X80-4N; DB_CERTIFIED: AUT; DB_APPROVED_BY: VSN; DB_STATUS: NEW; DB_PART_NUMBER: OSC000000015; DB_APPROVED_ON: 09.01.2013 13:52:02; DB_DATASHEET: http://john.epiqdesign.com/projects/CIS_Datasheets/DSO211AR.pdf?rev=1025&sc=0